# Altium project ee_453_Nakseung Choi.PrjPcb
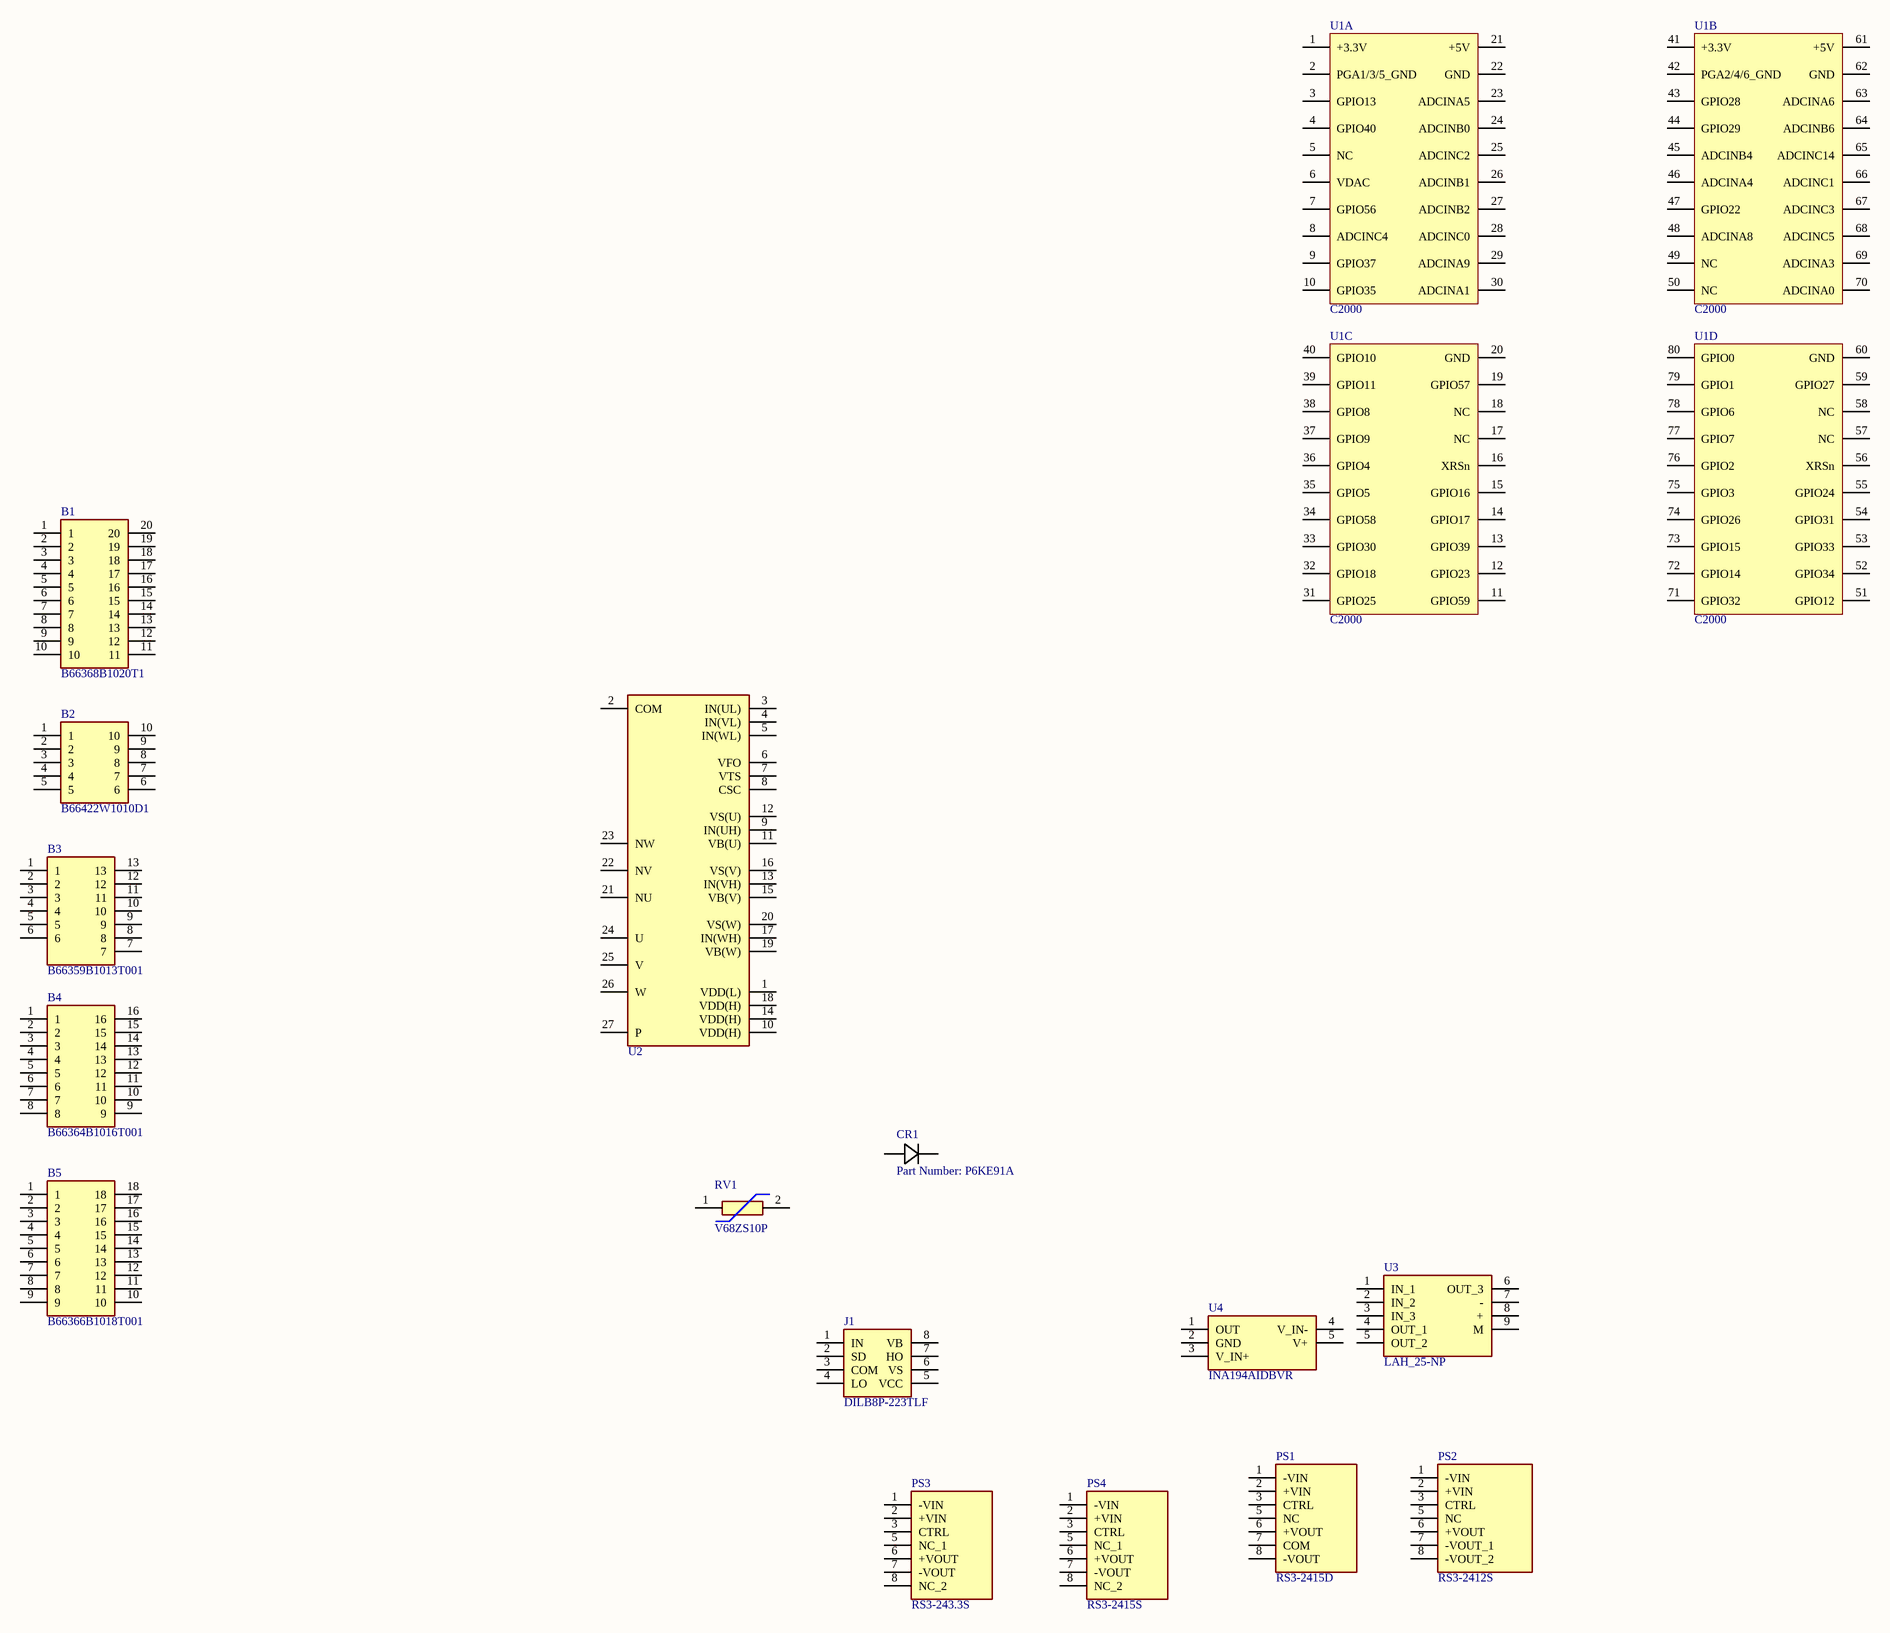
[diagram p0: ee453_pcb_Nakseung Choi.SchDoc]
5 sheets, 144 parts. Net scope: flat (ports and power ports of the same name join across sheets).
Sheets:
  ee453_pcb_Nakseung Choi.SchDoc
  Power.SchDoc
  Boostconverter.SchDoc
  Inverter.SchDoc
  MCU.SchDoc

## Sheet ee453_pcb_Nakseung Choi.SchDoc: EE 453 Capstone
size C; ApprovedBy: Nakseung Choi; CheckedBy: Nakseung Choi; Author: Nakseung Choi; CompanyName: Dept. of Elec. and Comp. Engg.; DrawnBy: Nakseung Choi; Engineer: Nakseung Choi; Organization: UW-Seattle; Address1: 185 Stevens Way; Address2: Paul Allen Center; Address3: Seattle, WA; Address4: US-98195; DocumentNumber: 1; Revision: 1.0; SheetNumber: 1; SheetTotal: 5

### Parts
(Parts that share a designator on the sheet are numbered #1, #2 ... from top to bottom, then left to right.)
B1  B66368B1020T1  [B66368B1020T1]
B2  B66422W1010D1  [B66422W1010D1]
B3  B66359B1013T001  [B66359B1013T001]
B4  B66364B1016T001  [B66364B1016T001]
B5  B66366B1018T001  [B66366B1018T001]
CR1  Part Number: P6KE91A  [P6KESeries]
J1#1  DILB8P-223TLF  [DIPS762W60P254L1016H525Q8N]
PS1#1  RS3-2415D  [RS32405DH3]
PS2#1  RS3-2412S  [RS32415S]
PS3#1  RS3-243.3S  [RS32433S]
PS4  RS3-2415S  [RS32415S]
RV1#1  V68ZS10P  [V68ZS10P]
U1#1  C2000  [C2000]  (parts A,B,C,D of 4)
U2#1  FNB34060T  [FNB34060T]  (value not drawn)
U3#1  LAH_25-NP  [LAH-25-NP]
U4  INA194AIDBVR  [SOT95P280X145-5N]

### Nets

Not connected (* = marked no-connect by the designer): B1 1 2 3 4 5 6 7 8 9 10 11 12 13 14 15 16 17 18 19 20; B2 1 2 3 4 5 6 7 8 9 10; B3 1 2 3 4 5 6 7 8 9 10 11 12 13; B4 1 2 3 4 5 6 7 8 9 10 11 12 13 14 15 16; B5 1 2 3 4 5 6 7 8 9 10 11 12 13 14 15 16 17 18; CR1 1 2; J1#1 1(IN) 2(SD) 3(COM) 4(LO) 5(VCC) 6(VS) 7(HO) 8(VB); PS1#1 1(-VIN) 2(+VIN) 3(CTRL) 5(NC) 6(+VOUT) 7(COM) 8(-VOUT); PS2#1 1(-VIN) 2(+VIN) 3(CTRL) 5(NC) 6(+VOUT) 7(-VOUT_1) 8(-VOUT_2); PS3#1 1(-VIN) 2(+VIN) 3(CTRL) 5(NC_1) 6(+VOUT) 7(-VOUT) 8(NC_2); PS4 1(-VIN) 2(+VIN) 3(CTRL) 5(NC_1) 6(+VOUT) 7(-VOUT) 8(NC_2); RV1#1 1 2; U1#1 1(+3.3V) 2(PGA1/3/5_GND) 3(GPIO13) 4(GPIO40) 5(NC) 6(VDAC) 7(GPIO56) 8(ADCINC4) 9(GPIO37) 10(GPIO35) 11(GPIO59) 12(GPIO23) 13(GPIO39) 14(GPIO17) 15(GPIO16) 16(XRSn) 17(NC) 18(NC) 19(GPIO57) 20(GND) 21(+5V) 22(GND) 23(ADCINA5) 24(ADCINB0) 25(ADCINC2) 26(ADCINB1) 27(ADCINB2) 28(ADCINC0) 29(ADCINA9) 30(ADCINA1) 31(GPIO25) 32(GPIO18) 33(GPIO30) 34(GPIO58) 35(GPIO5) 36(GPIO4) 37(GPIO9) 38(GPIO8) 39(GPIO11) 40(GPIO10) 41(+3.3V) 42(PGA2/4/6_GND) 43(GPIO28) 44(GPIO29) 45(ADCINB4) 46(ADCINA4) 47(GPIO22) 48(ADCINA8) 49(NC) 50(NC) 51(GPIO12) 52(GPIO34) 53(GPIO33) 54(GPIO31) 55(GPIO24) 56(XRSn) 57(NC) 58(NC) 59(GPIO27) 60(GND) 61(+5V) 62(GND) 63(ADCINA6) 64(ADCINB6) 65(ADCINC14) 66(ADCINC1) 67(ADCINC3) 68(ADCINC5) 69(ADCINA3) 70(ADCINA0) 71(GPIO32) 72(GPIO14) 73(GPIO15) 74(GPIO26) 75(GPIO3) 76(GPIO2) 77(GPIO7) 78(GPIO6) 79(GPIO1) 80(GPIO0); U2#1 1(VDD(L)) 2(COM) 3(IN(UL)) 4(IN(VL)) 5(IN(WL)) 6(VFO) 7(VTS) 8(CSC) 9(IN(UH)) 10(VDD(H)) 11(VB(U)) 12(VS(U)) 13(IN(VH)) 14(VDD(H)) 15(VB(V)) 16(VS(V)) 17(IN(WH)) 18(VDD(H)) 19(VB(W)) 20(VS(W)) 21(NU) 22(NV) 23(NW) 24(U) 25(V) 26(W) 27(P); U3#1 1(IN_1) 2(IN_2) 3(IN_3) 4(OUT_1) 5(OUT_2) 6(OUT_3) 7(-) 8(+) 9(M); U4 1(OUT) 2(GND) 3(V_IN+) 4(V_IN-) 5(V+)

### Notes on the sheet
- Title
- Size:
- Date:
- File:
- C
- Number:
- Time:
- Revision:
- Sheet
- of

### Library data of the parts
B1 = B66368B1020T1: Bobbin; Manufacturer_Name: EPCOS; Datasheet Link: https://componentsearchengine.com/Datasheets/1/B66368B1020T1.pdf; Height: 40.9mm; Mouser2 Part Number: 871-B66368B1020T1; Mouser2 Price/Stock: https://www.mouser.com/Search/Refine.aspx?Keyword=871-B66368B1020T1; Manufacturer_Part_Number: B66368B1020T1
B2 = B66422W1010D1: Bobbin; Manufacturer_Name: EPCOS; Datasheet Link: https://componentsearchengine.com/Datasheets/1/B66422W1010D1.pdf; Height: 12mm; Mouser2 Part Number: 871-B66422W1010D1; Mouser2 Price/Stock: https://www.mouser.com/Search/Refine.aspx?Keyword=871-B66422W1010D1; Manufacturer_Part_Number: B66422W1010D1
B3 = B66359B1013T001: Bobbin; Manufacturer_Name: EPCOS; Datasheet Link: https://componentsearchengine.com/Datasheets/1/B66359B1013T001.pdf; Height: 25mm; Mouser2 Part Number: 871-B66359B1013T001; Mouser2 Price/Stock: https://www.mouser.com/Search/Refine.aspx?Keyword=871-B66359B1013T001; Manufacturer_Part_Number: B66359B1013T001
B4 = B66364B1016T001: Bobbin; Manufacturer_Name: EPCOS; Datasheet Link: https://componentsearchengine.com/Datasheets/1/B66364B1016T001.pdf; Height: 35.5mm; Mouser2 Part Number: 871-B66364B1016T001; Mouser2 Price/Stock: https://www.mouser.com/Search/Refine.aspx?Keyword=871-B66364B1016T001; Manufacturer_Part_Number: B66364B1016T001
B5 = B66366B1018T001: Bobbin; Manufacturer_Name: EPCOS; Datasheet Link: http://uk.rs-online.com/web/p/products/1620179; Height: 38.4mm; Manufacturer_Part_Number: B66366B1018T001; RS Part Number: 1620179; RS Price/Stock: http://uk.rs-online.com/web/p/products/1620179
CR1 = P6KE91A: No Description Available; Vendor: Littelfuse Inc; Built_By: EMA_UL_Team; Type: DEV; Manufacturer_Part_Number: P6KE91A; Copyright: Copyright (C) 2018 Accelerated Designs. All rights reserved; RefDes: RefDes; Value: Value
J1#1 = DILB8P-223TLF: Connector; Manufacturer_Name: Amphenol; Datasheet Link: https://componentsearchengine.com/Datasheets/1/DILB8P-223TLF.pdf; Height: 5.25mm; Mouser2 Part Number: 649-DILB8P223TLF; Mouser2 Price/Stock: https://www.mouser.com/Search/Refine.aspx?Keyword=649-DILB8P223TLF; Manufacturer_Part_Number: DILB8P-223TLF
PS1#1 = RS3-2415D: Power Supply; Manufacturer_Name: RECOM Power; Allied_Number: 70052275; Datasheet Link: https://www.recom-power.com/pdf/Econoline/RS3-S_D_Z.pdf; Height: 11.35mm; Manufacturer_Part_Number: RS3-2415D; Mouser Part Number: 919-RS3-2415D; Mouser Price/Stock: https://www.mouser.com/Search/Refine.aspx?Keyword=919-RS3-2415D; RS Part Number: 1669089; RS Price/Stock: https://uk.rs-online.com/web/p/products/1669089; Allied Price/Stock: https://www.alliedelec.com/recom-power-inc-rs3-2415d/70052275/
PS2#1 = RS3-2412S: Power Supply; Manufacturer_Name: RECOM Power; Datasheet Link: https://www.recom-power.com/pdf/Econoline/RS3-S_D_Z.pdf; Manufacturer_Part_Number: RS3-2412S; Mouser Part Number: 919-RS3-2412S; Mouser Price/Stock: https://www.mouser.com/Search/Refine.aspx?Keyword=919-RS3-2412S; RS Part Number: 1669097; RS Price/Stock: https://uk.rs-online.com/web/p/products/1669097
PS3#1 = RS3-243.3S: Power Supply; Manufacturer_Name: RECOM Power; Datasheet Link: https://www.arrow.com/en/products/rs3-243.3s/recom-power; Height: 11.35mm; Manufacturer_Part_Number: RS3-243.3S; Mouser Part Number: 919-RS3-243.3S; Mouser Price/Stock: https://www.mouser.com/Search/Refine.aspx?Keyword=919-RS3-243.3S; RS Part Number: 0163748P; RS Price/Stock: http://uk.rs-online.com/web/p/products/0163748P
PS4 = RS3-2415S: Power Supply; Manufacturer_Name: RECOM Power; Datasheet Link: https://www.recom-power.com/pdf/Econoline/RS3-S_D_Z.pdf; Height: 11.35mm; Manufacturer_Part_Number: RS3-2415S; Mouser Part Number: 919-RS3-2415S; Mouser Price/Stock: https://www.mouser.com/Search/Refine.aspx?Keyword=919-RS3-2415S
RV1#1 = V68ZS10P: Varistor; Manufacturer_Name: LITTELFUSE; Datasheet Link: http://www.littelfuse.com/~/media/electronics/datasheets/varistors/littelfuse_varistor_za_datasheet.pdf.pdf; Height: 20mm; Manufacturer_Part_Number: V68ZS10P
U1#1 = C2000: F280049C; Parameter 1: test 2
U3#1 = LAH_25-NP: Integrated Circuit; Manufacturer_Name: LEM; Manufacturer_Part_Number: LAH 25-NP; Datasheet Link: http://www.lem.com/docs/products/lah_25-np.pdf
U4 = INA194AIDBVR: Integrated Circuit; Manufacturer_Name: Texas Instruments; Datasheet Link: http://www.ti.com/lit/gpn/ina194; Height: 1.45mm; Manufacturer_Part_Number: INA194AIDBVR

## Sheet Power.SchDoc: Power
size A; DrawnBy: Nakseung Choi; Address1: 185 Stevens Way; DocumentNumber: 2; Revision: 1; SheetNumber: 2; SheetTotal: 5; SPICEModelCache: <root> / <DocumentId>WRYDTJPY</DocumentId> / <CacheFrame Number="0"> / <Model Name="cap" Kind="MDL"> / <Text>*Default semiconductor capacitor / .MODEL CAP C()</Text> / </Model> / <Model Name="ad645a" Kind="CKT"> / <Text>* AD645A SPICE Macro-model                  4/92, Rev. B / *                                           JCB / PMI / * / * Revision History: / *     Rev. B:  Converted model to include noise analysis. / * / * This version of the AD645 model simulates the worst case / * parameters of the 'A' grade.  The worst case parameters / * used correspond to those in the data sheet. / * / * Copyright 1990 by Analog Devices, Inc. / * / * Refer to "README.DOC" file for License Statement.  Use of this model / * indicates your acceptance with the terms and provisions in the License Statement. / * / * Node assignments / *                non-inverting input / *                |   inverting input / *                |   |   positive supply / *                |   |   |   negative supply / *                |   |   |   |   output / *                |   |   |   |   | / .SUBCKT AD645A   1   2   99  50  30 / * / * INPUT STAGE &amp; POLE AT 40 MHZ / * / R3   5  50    1.049 / R4   6  50    1.049 / CIN  1   2    1E-12 / C2   5   6    1.90E-9 / I1   99  4    100E-3 / IOS  1   2    0.5E-12 / EOS  65  1    POLY(1)  17 24  500E-6  1 / J1   5   2    4   JX / J2   6   7    4   JX / EN   7  65    43  0  1 / GN1  0   1    47  0  1E-6 / GN2  0   2    61  0  1E-6 / GB1  2  50    POLY(3) 4,2 5,2 50,2 0 1E-12 1E-12 1E-12 / GB2  7  50    POLY(3) 4,7 6,7 50,7 0 1E-12 1E-12 1E-12 / * / EREF 98  0    24  0   1 / * / * VOLTAGE NOISE GENERATOR / * / VN1  41  0    DC 2 / RS1  41 42    11.8E3 / RS2  42 43    1.2E9 / CS1  42 43    79.8E-11 / RS3  43 44    1.2E9 / CS2  43 44    79.8E-11 / RS4  44 45    11.8E3 / VN2  0  45    DC 2 / * / * CURRENT NOISE GENERATOR / * / VN3  46  0    DC 2 / RN5  46 47    144 / RN6  47 48    144 / VN4  0  48    DC 2 / * / * CURRENT NOISE GENERATOR / * / VN5  60  0    DC 2 / RN7  60 61    144 / RN8  61 62    144 / VN6  0  62    DC 2 / * / * SECOND STAGE &amp; POLE AT 3 HZ / * / R5   9  98    5.26E5 / C3   9  98    1.00E-7 / G1   98  9    5  6  9.53E-1 / V2   99  8    4.7 / V3   10 50    4.7 / D1   9   8    DX / D2   10  9    DX / * / * NEGATIVE ZERO AT 15 MHZ / * / R6   11 12     1E6 / C4   11 12     -10.6E-15 / R7   12 98     1 / E2   11 98     9  24  1E6 / * / * POLE AT 40 MHZ / * / R8   13 98     1E3 / C5   13 98     3.98E-12 / G2   98 13     12 24  1E-3 / * / * POLE AT 40 MHZ / * / R9   14 98     1E3 / C6   14 98     3.98E-12 / G3   98 14     13 24  1E-3 / * / * POLE AT 40 MHZ / * / R10  15 98     1E3 / C7   15 98     3.98E-12 / G4   98 15     14 24  1E-3 / * / * COMMON-MODE GAIN NETWORK WITH ZERO AT 600 HZ / * / R11  16 17     1E6 / C8   16 17     2.65E-10 / R12  17 98     1 / E3   16 98     POLY(2) 1  98  2  98  0  15.8  15.8 / * / * POLE AT 40 MHZ / * / R13  18 98     1E3 / C9   18 98     3.98E-12 / G5   98 18     15 24  1E-3 / * / * OUTPUT STAGE / * / R14  24 99     2000E3 / R15  24 50     2000E3 / ISY  99 50     -96.5E-3 / R16  29 99     360 / R17  29 50     360 / L1   29 30     1E-8 / G6   27 50     18 29  2.78E-3 / G7   28 50     29 18  2.78E-3 / G8   29 99     99 18  2.78E-3 / G9   50 29     18 50  2.78E-3 / V4   25 29     2.0 / V5   29 26     2.0 / D3   18 25     DX / D4   26 18     DX / D5   99 27     DX / D6   99 28     DX / D7   50 27     DY / D8   50 28     DY / F1   29  0     V4  1 / F2   0  29     V5  1 / * / * MODELS USED / * / .MODEL JX PJF(BETA=4.54  VTO=-2.000  IS=2.5E-12 RD=0.1 / + RS=0.1 CGD=1E-15 CGS=1E-15) / .MODEL DX   D(IS=1E-15 RS=10 CJO=1E-15) / .MODEL DY   D(IS=1E-15 BV=50 RS=10 CJO=1E-15) / .MODEL DEN  D(IS=1E-12 RS=7409.6 KF=2.051E-15 AF=1) / .MODEL DIN  D(IS=1E-12 RS=41.5 KF=0 AF=1) / .ENDS AD645A</Text> / </Model> / <Model Name="led0" Kind="MDL"> / <Text>*Typ INFRARED GaAs LED: Vf=1.2V Vr=5V If=40mA trr=3uS / *LED Pinout: 1=A, 2=K / .MODEL LED0 D (IS=93.5P RS=84M N=2.63 BV=5 IBV=10U / + CJO=2.97P VJ=.75 M=.333 TT=4.32U)</Text> / </Model> / <Model Name="led1" Kind="MDL"> / <Text>*Typ RED GaAs LED: Vf=1.7V Vr=4V If=40mA trr=3uS / *LED Pinout: 1=A, 2=K / .MODEL LED1 D (IS=93.2P RS=42M N=3.73 BV=4 IBV=10U / + CJO=2.97P VJ=.75 M=.333 TT=4.32U)</Text> / </Model> / <Model Name="led2" Kind="MDL"> / <Text>*Typ RED,GREEN,YELLOW,AMBER GaAs LED: Vf=2.1V Vr=4V If=40mA trr=3uS / *LED Pinout: 1=A, 2=K / .MODEL LED2 D (IS=93.1P RS=42M N=4.61 BV=4 IBV=10U / + CJO=2.97P VJ=.75 M=.333 TT=4.32U)</Text> / </Model> / <Model Name="led3" Kind="MDL"> / <Text>*Typ BLUE SiC LED: Vf=3.4V Vr=5V If=40mA trr=3uS / *LED Pinout: 1=A, 2=K / .MODEL LED3 D (IS=93.1P RS=42M N=7.47 BV=5 IBV=30U / + CJO=2.97P VJ=.75 M=.333 TT=4.32U)</Text> / </Model> / </CacheFrame> / </root>
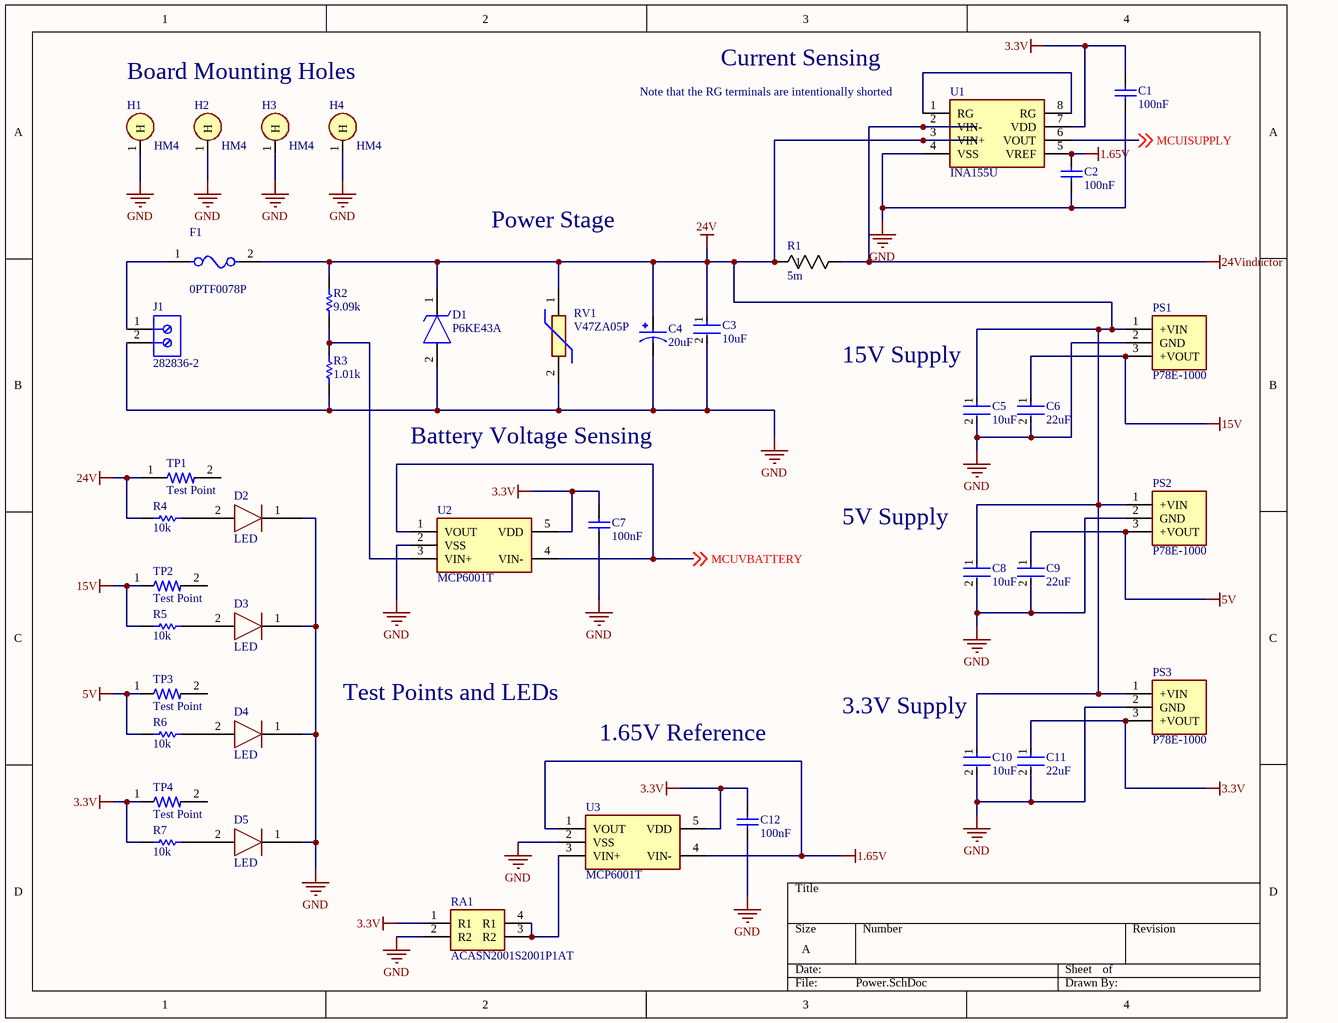
[diagram p1: Power.SchDoc]

### Parts
(Parts that share a designator on the sheet are numbered #1, #2 ... from top to bottom, then left to right.)
C1  100nF  [CAPC1609X100X15LL20]
C2  100nF  [CAPC1609X100X15LL20]
C3  10uF  [FP-CL31-IPC_C]
C4  20uF  [CAP_EEEFK1V180SR]
C5  10uF  [FP-CL31-IPC_C]
C6  22uF  [FP-RDEWK1-MFG]
C7  100nF  [CAPC1609X100X15LL20]
C8  10uF  [FP-CL31-IPC_C]
C9  22uF  [FP-RDEWK1-MFG]
C10  10uF  [FP-CL31-IPC_C]
C11  22uF  [FP-RDEWK1-MFG]
C12  100nF  [CAPC1609X100X15LL20]
D1  P6KE43A  [DIOAD1910W86L670D310]
D2  LED  [LED 0603]
D3  LED  [LED 0603]
D4  LED  [LED 0603]
D5  LED  [LED 0603]
F1  0PTF0078P  [FP-0PTF0078P-MFG]
H1  HM4  [M4 Hole]
H2  HM4  [M4 Hole]
H3  HM4  [M4 Hole]
H4  HM4  [M4 Hole]
J1#2  282836-2  [TECO-282836-2_V]
PS1#2  P78E-1000  [P78E-1000]
PS2#2  P78E-1000  [P78E-1000]
PS3#2  P78E-1000  [P78E-1000]
R1  5m  [RES_BR3_STP]
R2  9.09k  [RESC1609X50X30NL8T20]
R3  1.01k  [RESC1609X50X30NL8T20]
R4  10k  [RESC1609X50X30NL8T20]
R5  10k  [RESC1609X50X30NL8T20]
R6  10k  [RESC1609X50X30NL8T20]
R7  10k  [RESC1609X50X30NL8T20]
RA1  ACASN2001S2001P1AT  [0606]
RV1#2  V47ZA05P  [V68ZS10P]
TP1  Test Point  [RESC3216X70N]
TP2  Test Point  [RESC3216X70N]
TP3  Test Point  [RESC3216X70N]
TP4  Test Point  [RESC3216X70N]
U1#2  INA155U  [SOIC8]
U2#2  MCP6001T  [SOT-23]
U3#2  MCP6001T  [SOT-23]

### Nets
1.65V: C2.2 U1#2.5(VREF) U3#2.1(VOUT) U3#2.4(VIN-)
3.3V: C1.2 C7.2 C11.1 C12.2 PS3#2.3(+VOUT) R7.1 RA1.1(R1) TP4.1 U1#2.7(VDD) U2#2.5(VDD) U3#2.5(VDD)
5V: C9.1 PS2#2.3(+VOUT) R6.1 TP3.1
15V: C6.1 PS1#2.3(+VOUT) R5.1 TP2.1
24V: C3.1 C4.1 C5.1 C8.1 C10.1 D1.1(K) F1.2 PS1#2.1(+VIN) PS2#2.1(+VIN) PS3#2.1(+VIN) R1.1 R2.2 R4.1 RV1#2.1 TP1.1 U1#2.3(VIN+)
24Vinductor: R1.2 U1#2.2(VIN-)
GND: C1.1 C2.1 C3.2 C4.2 C5.2 C6.2 C7.1 C8.2 C9.2 C10.2 C11.2 C12.1 D1.2(A) D2.1 D3.1 D4.1 D5.1 H1.1(H) H2.1(H) H3.1(H) H4.1(H) J1#2.2 PS1#2.2(GND) PS2#2.2(GND) PS3#2.2(GND) R3.1 RA1.2(R2) RV1#2.2 U1#2.4(VSS) U2#2.2(VSS) U3#2.2(VSS)
MCUISUPPLY: U1#2.6(VOUT) ; off-sheet MCUISUPPLY
MCUVBATTERY: U2#2.1(VOUT) U2#2.4(VIN-) ; off-sheet MCUVBATTERY
NetD2_2: D2.2 R4.2
NetD3_2: D3.2 R5.2
NetD4_2: D4.2 R6.2
NetD5_2: D5.2 R7.2
NetF1_1: F1.1 J1#2.1
NetR2_1: R2.1 R3.2 U2#2.3(VIN+)
NetRA1_3: RA1.3(R2) RA1.4(R1) U3#2.3(VIN+)
NetU1#2_1: U1#2.1(RG) U1#2.8(RG)

Not connected (* = marked no-connect by the designer): TP1 2; TP2 2; TP3 2; TP4 2

### Notes on the sheet
- Board Mounting Holes
- (near U1#2) Note that the RG terminals are intentionally shorted
- Current Sensing
- Power Stage
- (near C5) 15V Supply
- Battery Voltage Sensing
- (near C8) 5V Supply
- Test Points and LEDs
- 1.65V Reference
- (near C10) 3.3V Supply

### Library data of the parts
C1 C2 C7 C12 = CMP-2006-00186-1: Manufacturer: AVX Interconnect / Elco; Part Number: TACL105M006XTA
C3 C5 C8 C10 = CMP-13271-001211-1: Cap Ceramic 220pF 500V C0G ±5% SMD 1206 +125°C Embossed T/R CL31C221JGFNNNF; Tolerance: 5%; Voltage Rating (DC): 500V; Depth: 1.6mm; Capacitance: 220pF; Max Operating Temperature: 125°C; Width: 0.063inch; Radiation Hardening: No; Thickness: 0.055inch; Packaging: Tape and Reel; Height: 1.25mm; Case/Package: 1206; Package Quantity: 10000; Dielectric: C0G; Mount: Surface Mount; Voltage Rating: 500V; Min Operating Temperature: -55°C; Length: 3.2mm
C4 = EEEFK1V180SR: CAP ALUM 18UF 20% 35V SMD; MF: Panasonic; Purchase-URL: https://pricing.snapeda.com/search/part/EEEFK1V180SR/?ref=eda; SnapEDA_Link: https://www.snapeda.com/parts/EEEFK1V180SR/Panasonic/view-part/?ref=snap; MP: EEEFK1V180SR; Value: *; Check_prices: https://www.snapeda.com/parts/EEEFK1V180SR/Panasonic/view-part/?ref=eda; Digi-Key_Part_Number: PCE5153TR-ND; Package: RADIAL-2 Panasonic
C6 C9 C11 = CMP-06035-003638-1: CAP CER 22UF 50V X7S RADIAL RDEC71H226MWK1H03B; Lead/Base Style: Formed Leads; Tolerance: 20%; Mount: Through Hole; Max Operating Temperature: 125°C; Capacitance: 22uF; Packaging: Bulk; Voltage Rating: 50V; Min Operating Temperature: -55°C; Case/Package: Radial
D1 = P6KE91A-E3_54: TVS Diode (Uni-directional); Manufacturer_Name: Vishay; Manufacturer_Part_Number: P6KE91A-E3/54; Datasheet Link: https://www.mouser.com/datasheet/2/427/p6ke-1767850.pdf
D2-D5 = LED: LED SMD
F1 = CMP-08604-000023-1: FUSE BLOCK CARTRIDGE PCB; Manufacturer: Littelfuse Inc; Number Of Fuses: 1; Conn Orientation: Vertical; Fuse Current: 6.3A; Voltage Rating Ac: 250V; Package: 0; Ambient Temperature Range Low: -30°C; ComponentLink2URL: https://media.digikey.com/pdf/Data%20Sheets/Littelfuse%20PDFs/PTF075_77_78.pdf; Device Class L3: unset; Lead Free: Yes; Device Class L1: Circuit Protection; RoHS: TRUE; Manufacturer Part Number: 0PTF0078P; Ambient Temperature Range High: +85°C; Category: Fuse; Octopart: https://octopart.com/0ptf0078p-littelfuse-13255855; Digikey Description: FUSE BLOCK CARTRIDGE PCB; Height: 11.5mm; ComponentLink2Description: Datasheet; Device Class L2: Fuse Holders; Mouser Description: Fuse Holder 5X20MM Pitch 22/7 UL94V0 Open; Automotive: No; Voltage Rating Dc: 250V
H1-H4 = HM4: M$ Mounting Hole
J1#2 = CMP-1684-00017-1: Female Header, Pitch 5 mm, 1 x 2 Position, Height 10 mm, Tail Length 3.5 mm, Rohs, Bulk; Manufacturer: TE Connectivity; Wire Gauge: 16-30AWG; Product Training Modules: Wire-to-BoardEurostyleTerminalBlocks; Clamp Material - Plating: Brass-NickelPlated; Voltage: 300V; Mating Orientation: HorizontalwithBoard; Current: 13.5A; Pitch: 0.197"(5.00mm); Screw Thread: M3; 3D Model: 282836-2.pdf; Other Names: 5ULV-02B / A98076; Dynamic Catalog: BuchananSeries; Number of Levels: 1; Torque - Screw: 0.68Nm(6Lb-In); Featured Product: EurostyleTerminalBlockConnectors; Positions Per Level: 2; Wire Termination: Screw-RisingCageClamp; Datasheet URL: http://www.te.com.cn/commerce/DocumentDelivery/DDEController?Action=showdoc&DocId=Catalog+Section%7F1308389_EUROSTYLE_TERMINAL_BLOCKS%7F0607%7Fpdf%7FEnglish%7FENG_CS_1308389_EUROSTYLE_TERMINAL_BLOCKS_0607.pdf%7F282836-2; Color: Green; Family: TerminalBlocks-WiretoBoard; RoHS Information: 282836-2StatementofCompliance; Standard Package: 300; Contact Material - Plating: Brass-TinPlated; Manufacturer URL: http://www.te.com; Housing Material: Polyamide(PA66),Nylon6/6; Features: Interlocking(Side); Package Description: Female Header, Pitch 5 mm, 1 x 2 Position, Height 10 mm, Tail Length 3.5 mm; Mounting Type: ThroughHole; Package Reference: THD; Packaging: Bulk; Series: Buchanan; Category: Connectors,Interconnects; Screw Material - Plating: Brass-NickelPlated
PS1#2 PS2#2 PS3#2 = P78E-1000: DC-DC Converter
R1 = BR3FB5L00: No Description Available; Mfr_Name: Stackpole International; Copyright: Copyright (C) 2022 Ultra Librarian. All rights reserved.; Manufacturer_Part_Number: BR3FB5L00; Digi-Key_Part_Number_1: BR3FB5L00-ND; RefDes: RefDes; Type: DEV
R2-R7 = CMP-2000-03816-5: Chip Resistor, 0 Ohm, Jumper, 100 mW, -55 to 155 degC, 0603 (1608 Metric), RoHS, Tape and Reel; Manufacturer: Vishay Semiconductor; Voltage Rating: 75 V; Package Quantity: 5000; DatasheetVersion: 06/2012; Min Operating Temperature: -55 degC; ComponentLink1URL: http://www.vishay.com/; Mounting Technology: Surface Mount; Height: 0.45 mm; ComponentLink1Description: Manufacturer URL; REACH SVHC: Unknown; PackageReference: 0603; Packaging: Tape and Reel; Max Operating Temperature: 155 degC; Mount: Surface Mount; ComponentLink2Description: Datasheet; PackageDescription: 2-Pin Surface Mount Device, Body 1.575 x 0.85 mm; Length: 1.55 mm; ComponentLink2URL: http://www.vishay.com/docs/20035/dcrcwe3.pdf; Pins: 2; RoHSCompliant: true
RA1 = ACASN2001S2001P1AT: Matched Resistor Array
RV1#2 = V68ZS10P: Varistor; Manufacturer_Name: LITTELFUSE; Datasheet Link: http://www.littelfuse.com/~/media/electronics/datasheets/varistors/littelfuse_varistor_za_datasheet.pdf.pdf; Height: 20mm; Manufacturer_Part_Number: V68ZS10P; Mouser Part Number: 576-V68ZS10P; Mouser Price/Stock: https://www.mouser.co.uk/ProductDetail/Littelfuse/V68ZS10P?qs=1%2FWRN91BpNvIRlTsONWDiQ%3D%3D
TP1-TP4 = RCWCTE: PC Test Point , Plating Surface Mount Mounting Type; MF: KOA Speer; Package: 1206 KOA Speer; Value: *; Price: None; Availability: Unavailable; MP: RCWCTE; SnapEDA_Link: https://www.snapeda.com/parts/RCWCTE/KOA%20Speer/view-part/1310479/?ref=snap
U1#2 = INA155U: In-Amp
U2#2 U3#2 = MCP6001T: Op-Amp

## Sheet Boostconverter.SchDoc
size A

## Sheet Inverter.SchDoc
size A; SPICEModelCacheCTQXAXMB: <root> / <DocumentId>CTQXAXMB</DocumentId> / <CacheFrame Number="0"> / <Model Name="cap" Kind="MDL"> / <Text>*Default semiconductor capacitor / .MODEL CAP C()</Text> / </Model> / <Model Name="zener" Kind="MDL"> / <Text>*ZENER / *Default Zener 10V @ 10mA / *Zener Diode Pinout: A,K / .MODEL ZENER D( BV=10 IBV=10E-3 )</Text> / </Model> / </CacheFrame> / </root>
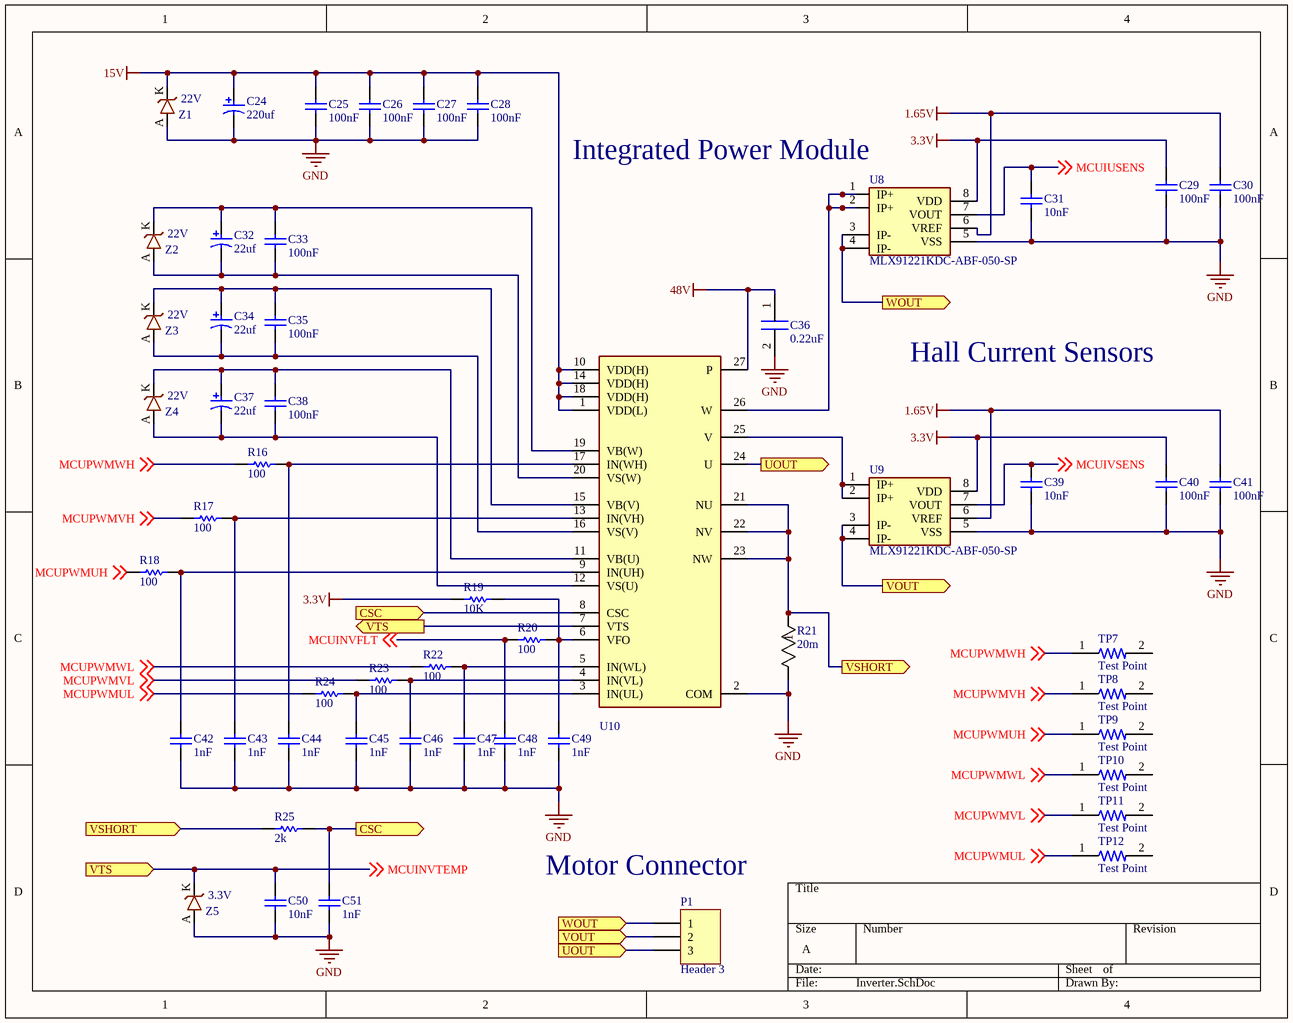
[diagram p2: Inverter.SchDoc]

### Parts
C24  220uf  [PNSC-ECA-1VM221-2]
C25  100nF  [CAPC1609X100X15LL20]
C26  100nF  [CAPC1609X100X15LL20]
C27  100nF  [CAPC1609X100X15LL20]
C28  100nF  [CAPC1609X100X15LL20]
C29  100nF  [CAPC1609X100X15LL20]
C30  100nF  [CAPC1609X100X15LL20]
C31  10nF  [CAPC1609X100X15LL20]
C32  22uf  [CAPPR55-200-1100X500X1200]
C33  100nF  [CAPC1609X100X15LL20]
C34  22uf  [CAPPR55-200-1100X500X1200]
C35  100nF  [CAPC1609X100X15LL20]
C36  0.22uF  [B32652A3224K000]
C37  22uf  [CAPPR55-200-1100X500X1200]
C38  100nF  [CAPC1609X100X15LL20]
C39  10nF  [CAPC1609X100X15LL20]
C40  100nF  [CAPC1609X100X15LL20]
C41  100nF  [CAPC1609X100X15LL20]
C42  1nF  [CAPC1609X100X15LL20]
C43  1nF  [CAPC1609X100X15LL20]
C44  1nF  [CAPC1609X100X15LL20]
C45  1nF  [CAPC1609X100X15LL20]
C46  1nF  [CAPC1609X100X15LL20]
C47  1nF  [CAPC1609X100X15LL20]
C48  1nF  [CAPC1609X100X15LL20]
C49  1nF  [CAPC1609X100X15LL20]
C50  10nF  [CAPC1609X100X15LL20]
C51  1nF  [CAPC1609X100X15LL20]
P1  Header 3  [3-Pin TB 5mm Pitch]
R16  100  [RESC1609X50X30NL8T20]
R17  100  [RESC1609X50X30NL8T20]
R18  100  [RESC1609X50X30NL8T20]
R19  10K  [RESC1609X50X30NL8T20]
R20  100  [RESC1609X50X30NL8T20]
R21  20m  [RES_BR3_STP]
R22  100  [RESC1609X50X30NL8T20]
R23  100  [RESC1609X50X30NL8T20]
R24  100  [RESC1609X50X30NL8T20]
R25  2k  [RESC1609X50X30NL8T20]
TP7  Test Point  [RESC3216X70N]
TP8  Test Point  [RESC3216X70N]
TP9  Test Point  [RESC3216X70N]
TP10  Test Point  [RESC3216X70N]
TP11  Test Point  [RESC3216X70N]
TP12  Test Point  [RESC3216X70N]
U8  MLX91221KDC-ABF-050-SP  [SOIC8]
U9  MLX91221KDC-ABF-050-SP  [SOIC8]
U10  FNB34060T  [FNB34060T]  (value not drawn)
Z1  22V  [DO-214AA]
Z2  22V  [DO-214AA]
Z3  22V  [DO-214AA]
Z4  22V  [DO-214AA]
Z5  3.3V  [SOD123]

### Ports
CSC (in), CSC (out), UOUT (in), UOUT (out), VOUT (in), VOUT (out), VSHORT (in), VSHORT (out), VTS (in), VTS (out), WOUT (in), WOUT (out)

### Nets
1.65V: C30.2 C41.2 U8.6(VREF) U9.6(VREF)
3.3V: C29.2 C40.2 R19.2 U8.8(VDD) U9.8(VDD)
15V: C24.1 C25.2 C26.2 C27.2 C28.2 U10.1(VDD(L)) U10.10(VDD(H)) U10.14(VDD(H)) U10.18(VDD(H)) Z1.K
48V: C36.1 U10.27(P)
GND: C24.2 C25.1 C26.1 C27.1 C28.1 C29.1 C30.1 C31.1 C36.2 C39.1 C40.1 C41.1 C42.1 C43.1 C44.1 C45.1 C46.1 C47.1 C48.1 C49.1 C50.1 C51.1 R21.2 U8.5(VSS) U9.5(VSS) U10.2(COM) Z1.A Z5.A
MCUINVFLT: C48.2 R20.2 ; off-sheet MCUINVFLT
MCUINVTEMP: C50.2 U10.7(VTS) Z5.K ; off-sheet MCUINVTEMP, port VTS
MCUIUSENS: C31.2 U8.7(VOUT) ; off-sheet MCUIUSENS
MCUIVSENS: C39.2 U9.7(VOUT) ; off-sheet MCUIVSENS
MCUPWMUH: R18.2 TP9.1 ; off-sheet MCUPWMUH
MCUPWMUL: R24.2 TP12.1 ; off-sheet MCUPWMUL
MCUPWMVH: R17.2 TP8.1 ; off-sheet MCUPWMVH
MCUPWMVL: R23.2 TP11.1 ; off-sheet MCUPWMVL
MCUPWMWH: R16.2 TP7.1 ; off-sheet MCUPWMWH
MCUPWMWL: R22.2 TP10.1 ; off-sheet MCUPWMWL
NetC32_1: C32.1 C33.2 U10.19(VB(W)) Z2.K
NetC32_2: C32.2 C33.1 U10.20(VS(W)) Z2.A
NetC34_1: C34.1 C35.2 U10.15(VB(V)) Z3.K
NetC34_2: C34.2 C35.1 U10.16(VS(V)) Z3.A
NetC37_1: C37.1 C38.2 U10.11(VB(U)) Z4.K
NetC37_2: C37.2 C38.1 U10.12(VS(U)) Z4.A
NetC42_2: C42.2 R18.1 U10.9(IN(UH))
NetC43_2: C43.2 R17.1 U10.13(IN(VH))
NetC44_2: C44.2 R16.1 U10.17(IN(WH))
NetC45_2: C45.2 R24.1 U10.3(IN(UL))
NetC46_2: C46.2 R23.1 U10.4(IN(VL))
NetC47_2: C47.2 R22.1 U10.5(IN(WL))
NetC49_2: C49.2 R19.1 R20.1 U10.6(VFO)
NetC51_2: C51.2 R25.1 U10.8(CSC) ; port CSC
NetP1_1: P1.1 U8.3(IP-) U8.4(IP-) ; port WOUT
NetP1_2: P1.2 U9.3(IP-) U9.4(IP-) ; port VOUT
NetP1_3: P1.3 U10.24(U) ; port UOUT
NetR21_1: R21.1 R25.2 U10.21(NU) U10.22(NV) U10.23(NW) ; port VSHORT
NetU8_1: U8.1(IP+) U8.2(IP+) U10.26(W)
NetU9_1: U9.1(IP+) U9.2(IP+) U10.25(V)

Not connected (* = marked no-connect by the designer): TP7 2; TP8 2; TP9 2; TP10 2; TP11 2; TP12 2

### Notes on the sheet
- (near U8) Integrated Power Module
- Hall Current Sensors
- (near P1) Motor Connector

### Library data of the parts
C24 = CMP-2000-05311-1: Aluminum Electrolytic Capacitor, 220 uF, +/- 20%, 35 V, -40 to 85 degC, 2-Pin THD, RoHS, Bulk; Manufacturer: Panasonic; Lifetime@Temperature: 2000Hrs@85degC; Rated Voltage: 35V; Ripple Current: 350mA; Type: Radial; Capacitance: 220µF; Package Reference: ECA-1VM221; Series: M; Operating Temp Range: -40to+85degC; Package Description: 2-Pin Axial Lead, Dia 8 mm, Body Length 12.5 mm; Datasheet Version: Mar-06; Datasheet URL: https://datasheet.ciiva.com/26341/441851-da-01-en-elko-eca1vm221-m-r-220myf-35v-85c-26341906.pdf; Operating Temp-Max: 85degC; Case Size/Dimension: Ø8x11.5mm; Manufacturer URL: http://www.panasonic.com/
C25-C31 C33 C35 C38-C51 = CMP-2006-00186-1: as C1 on sheet Power
C32 C34 C37 = CMP-1665-00036-2: Aluminum Electrolytic Capacitor, 22 uF, +/- 20%, 50 V, -40 to 85 degC, 2-Pin THD, RoHS, Bulk; Manufacturer: Panasonic; Ripple Current: 100mA; Life (Hours): 2000Hour; Voltage: 50V; Dissipation Factor: 0.12%; Leakage Current: 3uA; Lead/Base Style: Straight; Lead Diameter: 0.5mm; Max Operating Temperature: 85degC; Height: 11mm; Package Reference: CAPPR55-200-1100X500X1200; Radiation Hardening: No; RoHSCompliant: true; Termination: Radial; Case/Package: Radial; REACH SVHC: NoSVHC; Height - Seated (Max): 0.472inch; Min Operating Temperature: -40degC; Packaging: Bulk; Manufacturer URL: http://www.panasonic.com/; Length: 11mm; Tolerance: 20%; Voltage Rating: 50V; Voltage Rating (DC): 50V; Datasheet URL: https://industrial.panasonic.com/cdbs/www-data/pdf/RDF0000/ABA0000C1218.pdf; Lead Pitch: 2mm; Ripple Current (AC): 100mA; Package Description: 2-Pin Radial Lead, Dia 5 mm, Height 12 mm; Diameter: 5mm; Capacitance: 22uF; Datasheet Version: Rev. 05, 10/2016; Package Quantity: 200; Mount: ThroughHole
C36 = B32652A3224K000: Capacitor, Film, 15mm leads
P1 = Header 3: Header, 3-Pin; LatestRevisionDate: 17-Jul-2002; LatestRevisionNote: Re-released for DXP Platform.; Publisher: Altium Limited
R16-R20 R22-R25 = CMP-2000-03816-5: as R2 on sheet Power; Package Quantity: 5000; DatasheetVersion: 06/2012; Min Operating Temperature: -55 degC; ComponentLink1URL: http://www.vishay.com/; Mounting Technology: Surface Mount; Height: 0.45 mm; ComponentLink1Description: Manufacturer URL; REACH SVHC: Unknown; PackageReference: 0603; Packaging: Tape and Reel; Max Operating Temperature: 155 degC; Mount: Surface Mount; ComponentLink2Description: Datasheet; PackageDescription: 2-Pin Surface Mount Device, Body 1.575 x 0.85 mm; Length: 1.55 mm; ComponentLink2URL: http://www.vishay.com/docs/20035/dcrcwe3.pdf; Pins: 2; RoHSCompliant: true
R21 = BR3FB5L00: as R1 on sheet Power; Copyright: Copyright (C) 2022 Ultra Librarian. All rights reserved.; Manufacturer_Part_Number: BR3FB5L00; Digi-Key_Part_Number_1: BR3FB5L00-ND; RefDes: RefDes; Type: DEV
TP7-TP12 = RCWCTE: as TP1 on sheet Power; Package: 1206 KOA Speer; Value: *; Price: None; Availability: Unavailable; MP: RCWCTE; SnapEDA_Link: https://www.snapeda.com/parts/RCWCTE/KOA%20Speer/view-part/1310479/?ref=snap
U8 U9 = MLX91221KDC-ABF-050-SP: Hall Current Sensor
Z1-Z4 = D: Zener Diode, DO-214AA
Z5 = SOD123: Zener Diode, SOD123

## Sheet MCU.SchDoc
size A; SPICEModelCacheZTCALRQY: <root> / <DocumentId>ZTCALRQY</DocumentId> / <CacheFrame Number="0"> / <Model Name="cap" Kind="MDL"> / <Text>*Default semiconductor capacitor / .MODEL CAP C()</Text> / </Model> / </CacheFrame> / </root>
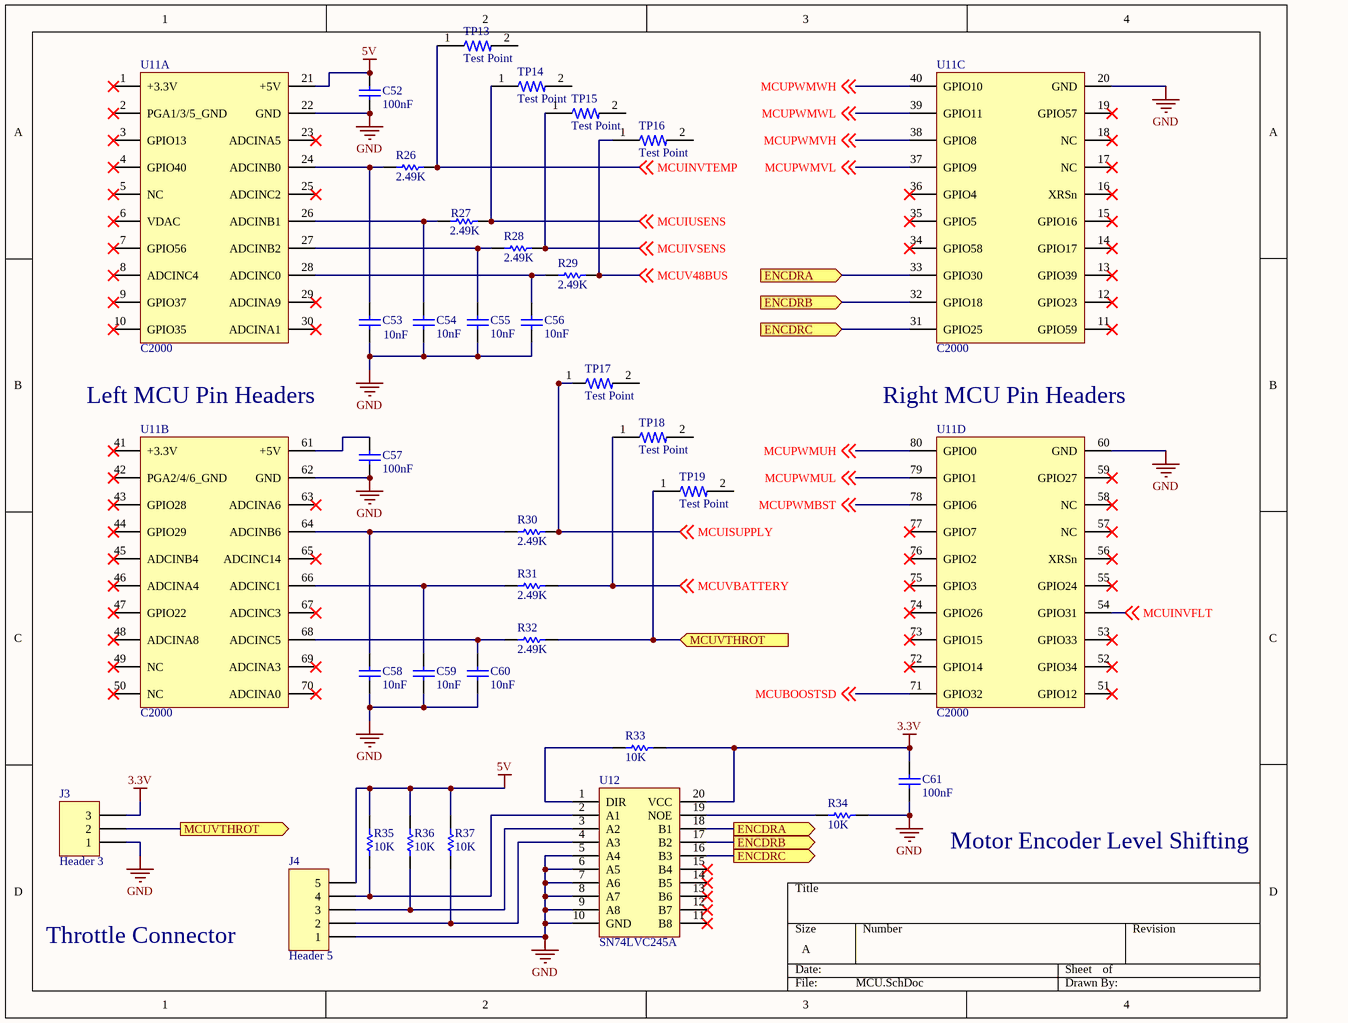
[diagram p3: MCU.SchDoc]

### Parts
C52  100nF  [CAPC1609X100X15LL20]
C53  10nF  [CAPC1609X100X15LL20]
C54  10nF  [CAPC1609X100X15LL20]
C55  10nF  [CAPC1609X100X15LL20]
C56  10nF  [CAPC1609X100X15LL20]
C57  100nF  [CAPC1609X100X15LL20]
C58  10nF  [CAPC1609X100X15LL20]
C59  10nF  [CAPC1609X100X15LL20]
C60  10nF  [CAPC1609X100X15LL20]
C61  100nF  [CAPC1609X100X15LL20]
J3  Header 3  [3-Pin TB 5mm Pitch]
J4  Header 5  [5-Pin TB 5mm Pitch]
R26  2.49K  [RESC1609X50X30NL8T20]
R27  2.49K  [RESC1609X50X30NL8T20]
R28  2.49K  [RESC1609X50X30NL8T20]
R29  2.49K  [RESC1609X50X30NL8T20]
R30  2.49K  [RESC1609X50X30NL8T20]
R31  2.49K  [RESC1609X50X30NL8T20]
R32  2.49K  [RESC1609X50X30NL8T20]
R33  10K  [RESC1609X50X30NL8T20]
R34  10K  [RESC1609X50X30NL8T20]
R35  10K  [RESC1609X50X30NL8T20]
R36  10K  [RESC1609X50X30NL8T20]
R37  10K  [RESC1609X50X30NL8T20]
TP13  Test Point  [RESC3216X70N]
TP14  Test Point  [RESC3216X70N]
TP15  Test Point  [RESC3216X70N]
TP16  Test Point  [RESC3216X70N]
TP17  Test Point  [RESC3216X70N]
TP18  Test Point  [RESC3216X70N]
TP19  Test Point  [RESC3216X70N]
U11  C2000  [C2000]  (parts A,B,C,D of 4)
U12  SN74LVC245A  [20TSSOP]

### Ports
ENCDRA (in), ENCDRA (out), ENCDRB (in), ENCDRB (out), ENCDRC (in), ENCDRC (out), MCUVTHROT (in), MCUVTHROT (out)

### Nets
3.3V: C61.2 J3.3 R33.2 U12.20(VCC)
5V: C52.2 J4.5 R35.2 R36.2 R37.2 U11.21(+5V)
GND: C52.1 C53.1 C54.1 C55.1 C56.1 C57.1 C58.1 C59.1 C60.1 C61.1 J3.1 J4.1 R34.2 U11.20(GND) U11.22(GND) U11.60(GND) U11.62(GND) U12.5(A4) U12.6(A5) U12.7(A6) U12.8(A7) U12.9(A8) U12.10(GND)
MCUBOOSTSD: U11.71(GPIO32) ; off-sheet MCUBOOSTSD
MCUINVFLT: U11.54(GPIO31) ; off-sheet MCUINVFLT
MCUINVTEMP: R26.2 TP13.1 ; off-sheet MCUINVTEMP
MCUISUPPLY: R30.2 TP17.1 ; off-sheet MCUISUPPLY
MCUIUSENS: R27.2 TP14.1 ; off-sheet MCUIUSENS
MCUIVSENS: R28.2 TP15.1 ; off-sheet MCUIVSENS
MCUPWMBST: U11.78(GPIO6) ; off-sheet MCUPWMBST
MCUPWMUH: U11.80(GPIO0) ; off-sheet MCUPWMUH
MCUPWMUL: U11.79(GPIO1) ; off-sheet MCUPWMUL
MCUPWMVH: U11.38(GPIO8) ; off-sheet MCUPWMVH
MCUPWMVL: U11.37(GPIO9) ; off-sheet MCUPWMVL
MCUPWMWH: U11.40(GPIO10) ; off-sheet MCUPWMWH
MCUPWMWL: U11.39(GPIO11) ; off-sheet MCUPWMWL
MCUV48BUS: R29.2 TP16.1 ; off-sheet MCUV48BUS
MCUVBATTERY: R31.2 TP18.1 ; off-sheet MCUVBATTERY
NetC53_2: C53.2 R26.1 U11.24(ADCINB0)
NetC54_2: C54.2 R27.1 U11.26(ADCINB1)
NetC55_2: C55.2 R28.1 U11.27(ADCINB2)
NetC56_2: C56.2 R29.1 U11.28(ADCINC0)
NetC57_2: C57.2 U11.61(+5V)
NetC58_2: C58.2 R30.1 U11.64(ADCINB6)
NetC59_2: C59.2 R31.1 U11.66(ADCINC1)
NetC60_2: C60.2 R32.1 U11.68(ADCINC5)
NetJ3_2: J3.2 R32.2 TP19.1 ; port MCUVTHROT
NetJ4_2: J4.2 R37.1 U12.4(A3)
NetJ4_3: J4.3 R36.1 U12.3(A2)
NetJ4_4: J4.4 R35.1 U12.2(A1)
NetR33_1: R33.1 U12.1(DIR)
NetR34_1: R34.1 U12.19(NOE)
NetU11_31: U11.31(GPIO25) U12.16(B3) ; port ENCDRC
NetU11_32: U11.32(GPIO18) U12.17(B2) ; port ENCDRB
NetU11_33: U11.33(GPIO30) U12.18(B1) ; port ENCDRA

Not connected (* = marked no-connect by the designer): TP13 2; TP14 2; TP15 2; TP16 2; TP17 2; TP18 2; TP19 2; U11 1(+3.3V)* 2(PGA1/3/5_GND)* 3(GPIO13)* 4(GPIO40)* 5(NC)* 6(VDAC)* 7(GPIO56)* 8(ADCINC4)* 9(GPIO37)* 10(GPIO35)* 11(GPIO59)* 12(GPIO23)* 13(GPIO39)* 14(GPIO17)* 15(GPIO16)* 16(XRSn)* 17(NC)* 18(NC)* 19(GPIO57)* 23(ADCINA5)* 25(ADCINC2)* 29(ADCINA9)* 30(ADCINA1)* 34(GPIO58)* 35(GPIO5)* 36(GPIO4)* 41(+3.3V)* 42(PGA2/4/6_GND)* 43(GPIO28)* 44(GPIO29)* 45(ADCINB4)* 46(ADCINA4)* 47(GPIO22)* 48(ADCINA8)* 49(NC)* 50(NC)* 51(GPIO12)* 52(GPIO34)* 53(GPIO33)* 55(GPIO24)* 56(XRSn)* 57(NC)* 58(NC)* 59(GPIO27)* 63(ADCINA6)* 65(ADCINC14)* 67(ADCINC3)* 69(ADCINA3)* 70(ADCINA0)* 72(GPIO14)* 73(GPIO15)* 74(GPIO26)* 75(GPIO3)* 76(GPIO2)* 77(GPIO7)*; U12 11(B8)* 12(B7)* 13(B6)* 14(B5)* 15(B4)*

### Notes on the sheet
- (near U11) Left MCU Pin Headers
- (near U11) Right MCU Pin Headers
- Motor Encoder Level Shifting
- Throttle Connector

### Library data of the parts
C52-C61 = CMP-2006-00186-1: as C1 on sheet Power
J3 = Header 3: Header, 3-Pin; LatestRevisionDate: 17-Jul-2002; LatestRevisionNote: Re-released for DXP Platform.; Publisher: Altium Limited
J4 = Header 5: Header, 5-Pin; LatestRevisionDate: 17-Jul-2002; LatestRevisionNote: Re-released for DXP Platform.; Publisher: Altium Limited
R26-R37 = CMP-2000-03816-5: as R2 on sheet Power; Package Quantity: 5000; DatasheetVersion: 06/2012; Min Operating Temperature: -55 degC; ComponentLink1URL: http://www.vishay.com/; Mounting Technology: Surface Mount; Height: 0.45 mm; ComponentLink1Description: Manufacturer URL; REACH SVHC: Unknown; PackageReference: 0603; Packaging: Tape and Reel; Max Operating Temperature: 155 degC; Mount: Surface Mount; ComponentLink2Description: Datasheet; PackageDescription: 2-Pin Surface Mount Device, Body 1.575 x 0.85 mm; Length: 1.55 mm; ComponentLink2URL: http://www.vishay.com/docs/20035/dcrcwe3.pdf; Pins: 2; RoHSCompliant: true
TP13-TP19 = RCWCTE: as TP1 on sheet Power; Package: 1206 KOA Speer; Value: *; Price: None; Availability: Unavailable; MP: RCWCTE; SnapEDA_Link: https://www.snapeda.com/parts/RCWCTE/KOA%20Speer/view-part/1310479/?ref=snap
U11 = C2000: F280049C; Parameter 1: test 2
U12 = SN74LVC245A: Logic Level Transciever

## Nets that join several sheets
1.65V: Power (C2.2 U1#2.5 U3#2.1 U3#2.4), Inverter (C30.2 C41.2 U8.6 U9.6)
3.3V: Power (11 pins), Inverter (5 pins), MCU (C61.2 J3.3 R33.2 U12.20)
5V: Power (C9.1 PS2#2.3 R6.1 TP3.1), MCU (6 pins)
15V: Power (C6.1 PS1#2.3 R5.1 TP2.1), Inverter (10 pins)
GND: Power (31 pins), Inverter (28 pins), MCU (23 pins)
MCUINVFLT: Inverter (C48.2 R20.2), MCU (U11.54)
MCUINVTEMP: Inverter (C50.2 U10.7 Z5.K), MCU (R26.2 TP13.1)
MCUISUPPLY: Power (U1#2.6), MCU (R30.2 TP17.1)
MCUIUSENS: Inverter (C31.2 U8.7), MCU (R27.2 TP14.1)
MCUIVSENS: Inverter (C39.2 U9.7), MCU (R28.2 TP15.1)
MCUPWMUH: Inverter (R18.2 TP9.1), MCU (U11.80)
MCUPWMUL: Inverter (R24.2 TP12.1), MCU (U11.79)
MCUPWMVH: Inverter (R17.2 TP8.1), MCU (U11.38)
MCUPWMVL: Inverter (R23.2 TP11.1), MCU (U11.37)
MCUPWMWH: Inverter (R16.2 TP7.1), MCU (U11.40)
MCUPWMWL: Inverter (R22.2 TP10.1), MCU (U11.39)
MCUVBATTERY: Power (U2#2.1 U2#2.4), MCU (R31.2 TP18.1)